# EAGLE design t8sw (EAGLE 5.11)
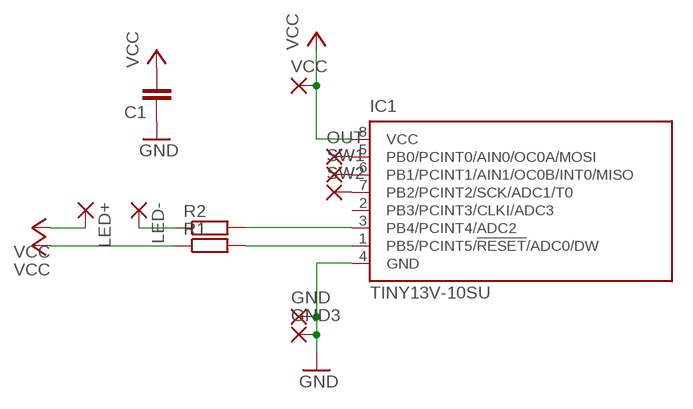
[diagram p0: schematic, sheet 1]

## Parts
C1  C-EUC0402  [C0402]
GND  SMD5  [SMD2,54-5,08]
GND3  SMD5  [SMD2,54-5,08]
IC1  TINY13V-10SU  [8S2]
LED+  SMD5  [SMD2,54-5,08]
LED-  SMD5  [SMD2,54-5,08]
OUT  SMD5  [SMD2,54-5,08]
R1  R-EU_R0402  [R0402]
R2  R-EU_R0402  [R0402]
SW1  SMD5  [SMD2,54-5,08]
SW2  SMD5  [SMD2,54-5,08]
VCC  SMD5  [SMD2,54-5,08]

## Nets
GND: C1.1 GND3.1(P) GND.1(P) IC1.4(GND)
N$1: IC1.5(PB0/PCINT0/AIN0/OC0A/MOSI) OUT.1(P)
N$2: IC1.6(PB1/PCINT1/AIN1/OC0B/INT0/MISO) SW1.1(P)
N$3: IC1.1(PB5/PCINT5/!RESET!/ADC0/DW) R1.2
N$4: IC1.3(PB4/PCINT4/ADC2) R2.2
N$5: LED-.1(P) R2.1
N$6: IC1.7(PB2/PCINT2/SCK/ADC1/T0) SW2.1(P)
VCC: C1.2 IC1.8(VCC) LED+.1(P) R1.1 VCC.1(P)
Unconnected: IC1.2(PB3/PCINT3/CLKI/ADC3)

## Library data of the parts
C1 = rcl:C-EU: CAPACITOR, European symbol
GND GND3 LED+ LED- OUT SW1 SW2 VCC = wirepad:SMD5: SMD PAD
IC1 = atmel:TINY13: 8-bit AVR Microcontroller with 1K Bytes In-System Programmable Flash Source: http://www.atmel.com/dyn/resources/prod_documents/2535S.pdf; MPN: ATTINY13V-10SU; OC_FARNELL: 9171584; OC_NEWARK: 96K6524
R1 R2 = rcl:R-EU_: RESISTOR, European symbol

## Board
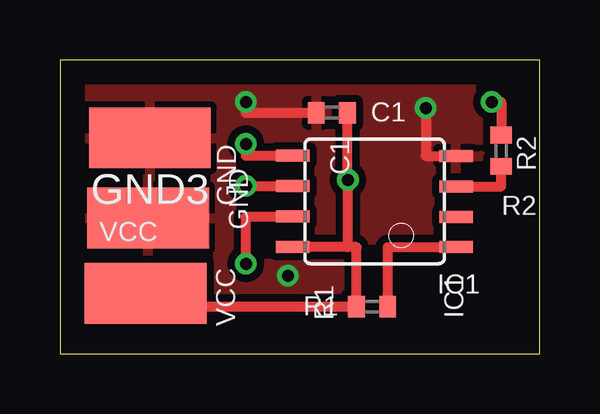
[diagram p1: board, top side]
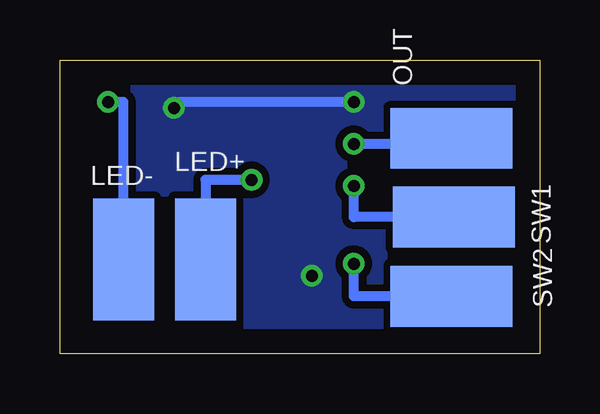
[diagram p2: board, bottom side, seen from below]

Size 20 x 12.25 mm. Coordinates in mm from the lower left corner, seen from the top.
Outline: 0,0 20,0 20,12.25 0,12.25 0,0
Copper layers (1*16): Top 0.035mm / dielectric 1.5mm / Bottom 0.035mm
Design rules "default *": minimum track width 10mil, minimum drill 24mil, track to track 8mil, track to pad 8mil, pad to pad 8mil, via to via 8mil, smd to smd 8mil, copper to edge 40mil, drill to drill 8mil, minimum pad ring 10mil, minimum via ring 8mil, stop-mask expansion 4mil, vias tented up to drill 30mil, thermal gap 10mil

### Footprints (pad centres in the part's own frame; a part is rotated, then mirrored left to right if it is on the bottom)
C0402 = smd 0.7 x 0.9: 1 -0.65,0; 2 0.65,0
SMD2,54-5,08 = smd 2.54 x 5.08: 1 0,0
8S2 = smd 0.5 x 1.4: 1 -1.905,-3.404; 2 -0.645,-3.404; 3 0.625,-3.404; 4 1.895,-3.404; 5 1.905,3.404; 6 0.635,3.404; 7 -0.635,3.404; 8 -1.905,3.404
R0402 = smd 0.7 x 0.9: 1 -0.65,0; 2 0.65,0

### Placement (x,y rotation side)
C1  11.34,10.05 0 top
GND  3.67,5.66 270 top
GND3  3.75,9 90 top
IC1  13.11,6.35 90 top
LED+  13.93,3.92 0 bottom
LED-  17.35,3.92 0 bottom
OUT  3.67,8.98 270 bottom
R1  13.02,1.96 0 top
R2  18.4,8.46 270 top
SW1  3.58,5.69 90 bottom
SW2  3.67,2.39 270 bottom
VCC  3.58,2.51 90 top

### Tracks (layer width: path | path; a pad name or v marks a point on that pad's centre or on a via)
GND  (via drill 0.5)
  Top 0.406: IC1.4 15.25,8.24 v15.25,10.25 | C1.1 7.75,10.05 v7.75,10.5
  Bottom 0.406: v15.25,10.25 15.25,10.5 v7.75,10.5
  other vias: 9.5,3.25
  pour Top (isolate 0.305): 0,0 20,0 20,12.25 0,12.25
  pour Bottom (isolate 0.305): 0,0 20,0 20,12.25 0,12.25
N$1  (via drill 0.5)
  Top 0.406: IC1.5 7.75,8.26 v7.75,8.75
  Bottom 0.406: v7.75,8.75 3.67,8.75 OUT.1
N$2  (via drill 0.5)
  Top 0.406: IC1.6 9.71,7 v7.75,7
  Bottom 0.406: v7.75,7 7.75,5.69 SW1.1
N$3
  Top 0.406: R1.2 13.67,4.45 IC1.1
N$4
  Top 0.406: IC1.3 18.4,6.97 R2.2
N$5  (via drill 0.5)
  Top 0.406: v18,10.5 18.4,10.5 R2.1
  Bottom 0.406: LED-.1 17.35,10.5 v18,10.5
N$6  (via drill 0.5)
  Top 0.406: IC1.7 7.75,5.71 v7.75,3.75
  Bottom 0.406: v7.75,3.75 7.75,2.39 SW2.1
VCC  (via drill 0.5)
  Top 0.406: 12.01,4.45 IC1.8 | 12.01,4.45 12.37,4.45 R1.1 3.58,1.96 VCC.1 | 12.01,4.45 v12.01,7.25 11.99,7.25 C1.2
  Bottom 0.406: LED+.1 13.93,7.25 v12.01,7.25

### Text on the board
bStop: LED- | OUT | LED+ | SW1 | SW2
_tNames: C1 | GND | R2 | VCC | IC1 | R1
_tValues: TINY13V-10SU